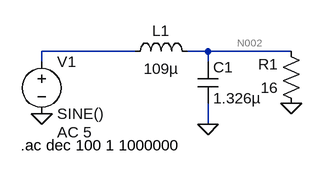
[diagram p0: schematic lab_3_RLC.asc]
lab_3_RLC.asc, the LTspice schematic file:
Version 4
SHEET 1 880 680
WIRE 320 144 176 144
WIRE 432 144 400 144
WIRE 560 144 432 144
WIRE 176 160 176 144
WIRE 432 160 432 144
WIRE 432 256 432 224
FLAG 432 256 0
FLAG 560 224 0
FLAG 176 240 0
SYMBOL res 576 240 R180
WINDOW 0 36 76 Left 2
WINDOW 3 36 40 Left 2
SYMATTR InstName R1
SYMATTR Value 16
SYMBOL cap 416 160 R0
SYMATTR InstName C1
SYMATTR Value 1.326µ
SYMBOL ind 304 160 R270
WINDOW 0 32 56 VTop 2
WINDOW 3 5 56 VBottom 2
SYMATTR InstName L1
SYMATTR Value 109µ
SYMBOL voltage 176 144 R0
WINDOW 123 24 124 Left 2
WINDOW 39 0 0 Left 0
SYMATTR Value2 AC 5
SYMATTR InstName V1
SYMATTR Value SINE()
TEXT 144 288 Left 2 !.ac dec 100 1 1000000

The netlist it stands for:
* lab_3_RLC.asc
R1 0 N002 16
C1 N002 0 1.326µ
L1 N001 N002 109µ
V1 N001 0 SINE() AC 5
.ac dec 100 1 1000000
.backanno
.end

* Results of the author's LTspice run, read from the files saved beside the schematic
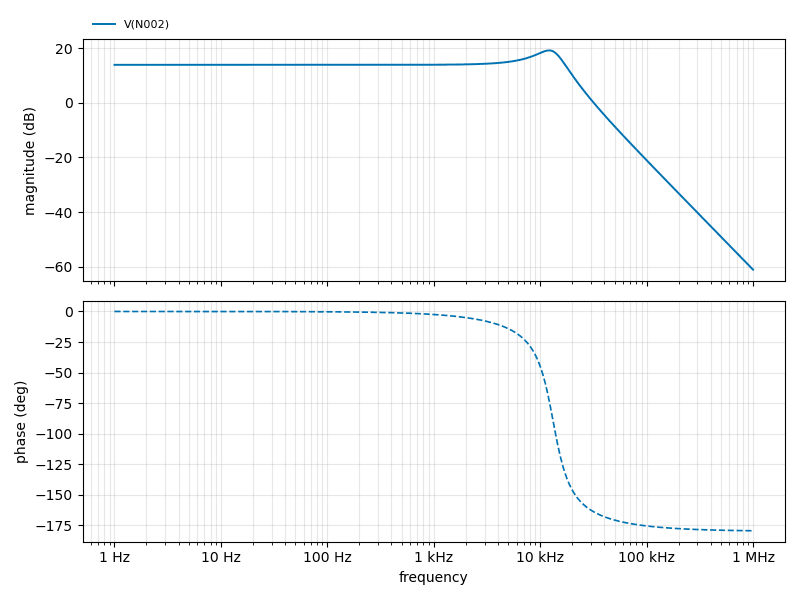
[diagram p1: AC Analysis of lab_3_RLC.asc, plotted from the saved traces]
* AC Analysis, 1 run:
*   V(N002): 13.98 dB at 1 Hz, -61.15 dB at 1 MHz, peak 19.27 dB at 12.02 kHz, 3 dB below the peak at 7.196 kHz and 15.57 kHz